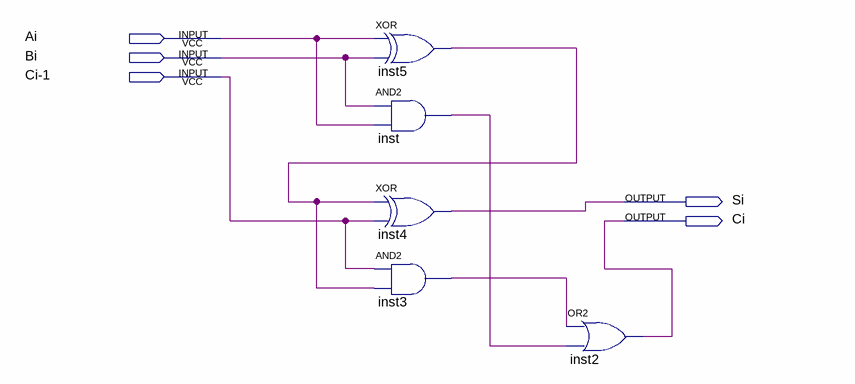
[diagram p0: schematic sheet]
// Quartus schematic fulladder.bdf as structural Verilog: 5 symbols, 5 pins
module fulladder (
  input  Ai,
  input  Bi,
  input  \Ci-1 ,
  output Si,
  output Ci
);

  wire inst3_out, inst5_out, inst_out;

  xor inst5 (inst5_out, Ai, Bi);
  and inst (inst_out, Bi, Ai);
  xor inst4 (Si, inst5_out, \Ci-1 );
  and inst3 (inst3_out, \Ci-1 , inst5_out);
  or inst2 (Ci, inst3_out, inst_out);
endmodule
